# EAGLE design powerSMALL_smaller_OUT_GND (EAGLE 9.0.0)
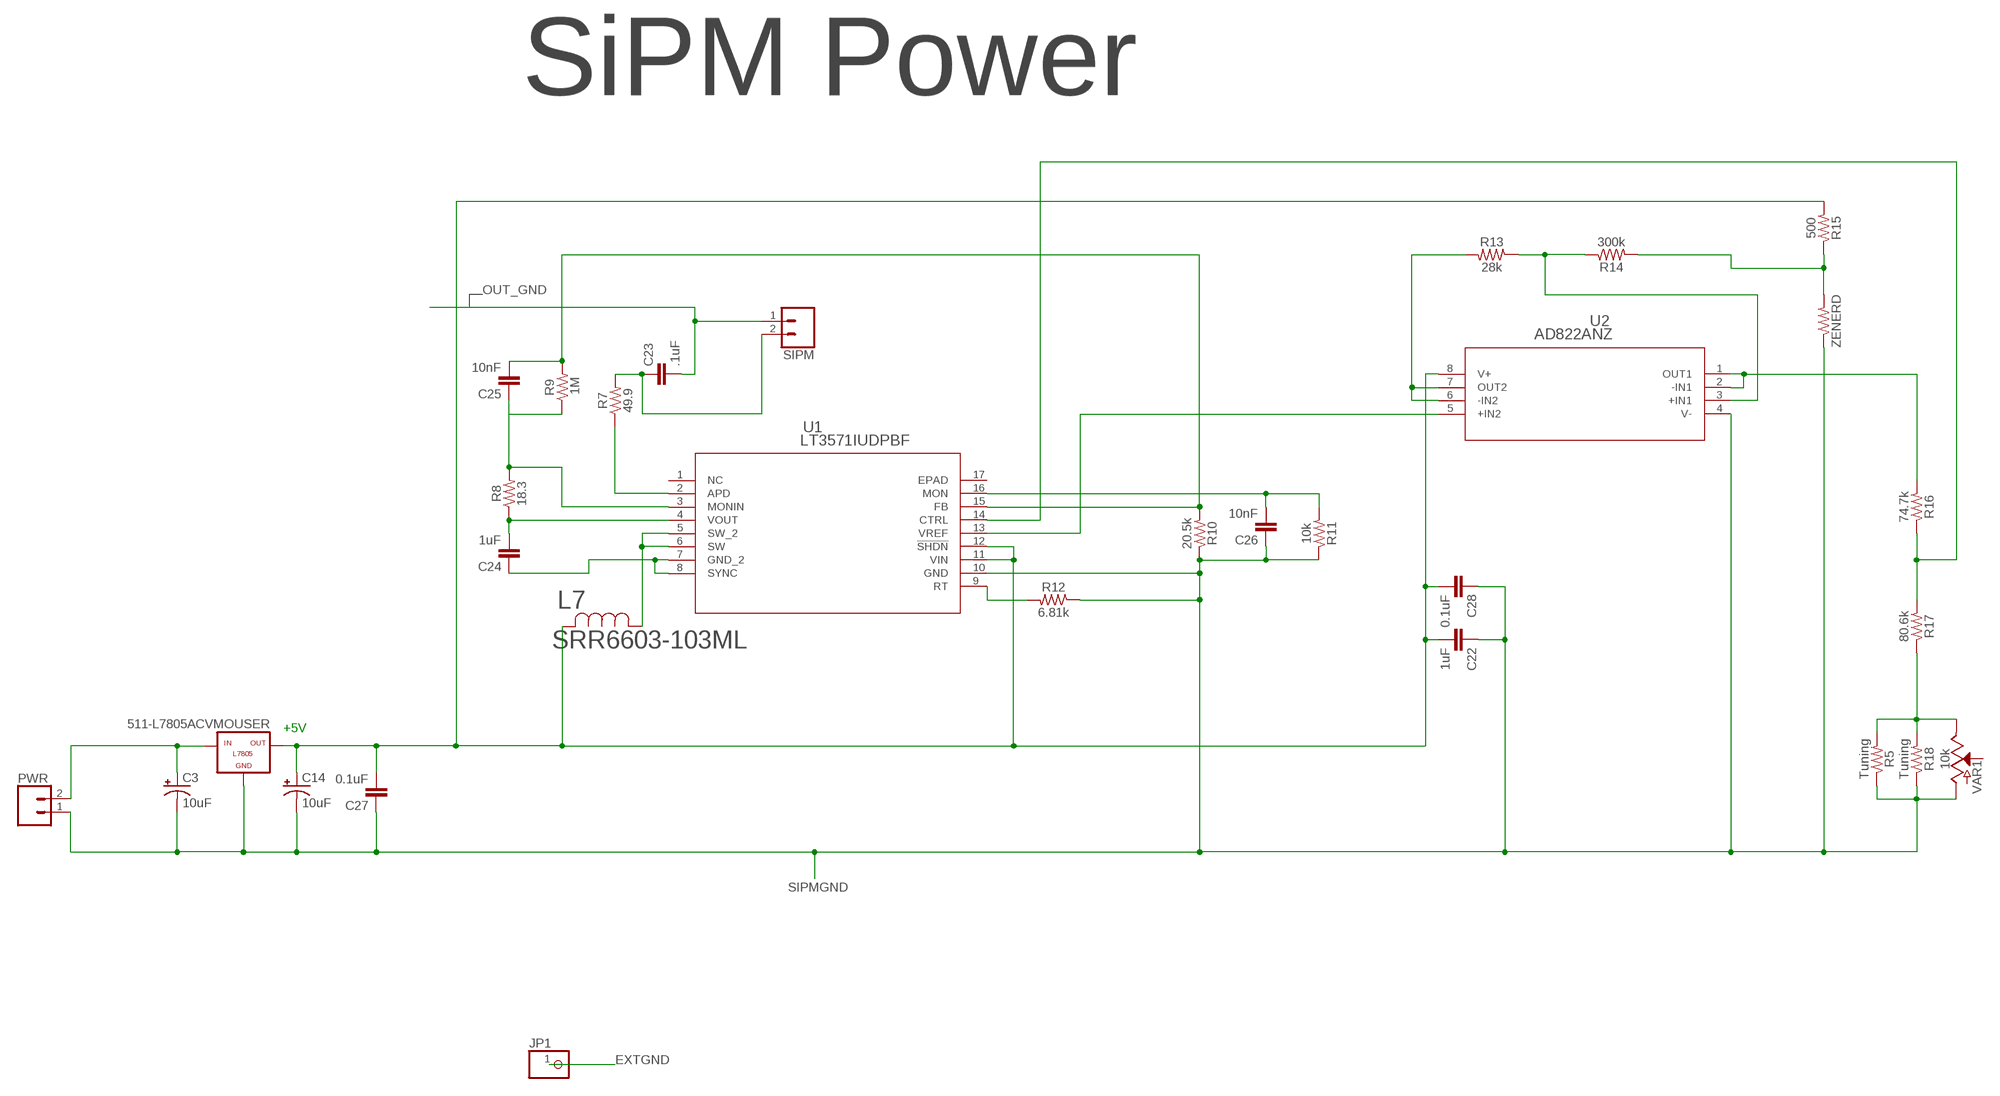
[diagram p0: schematic, sheet 1, part 1 of 2]
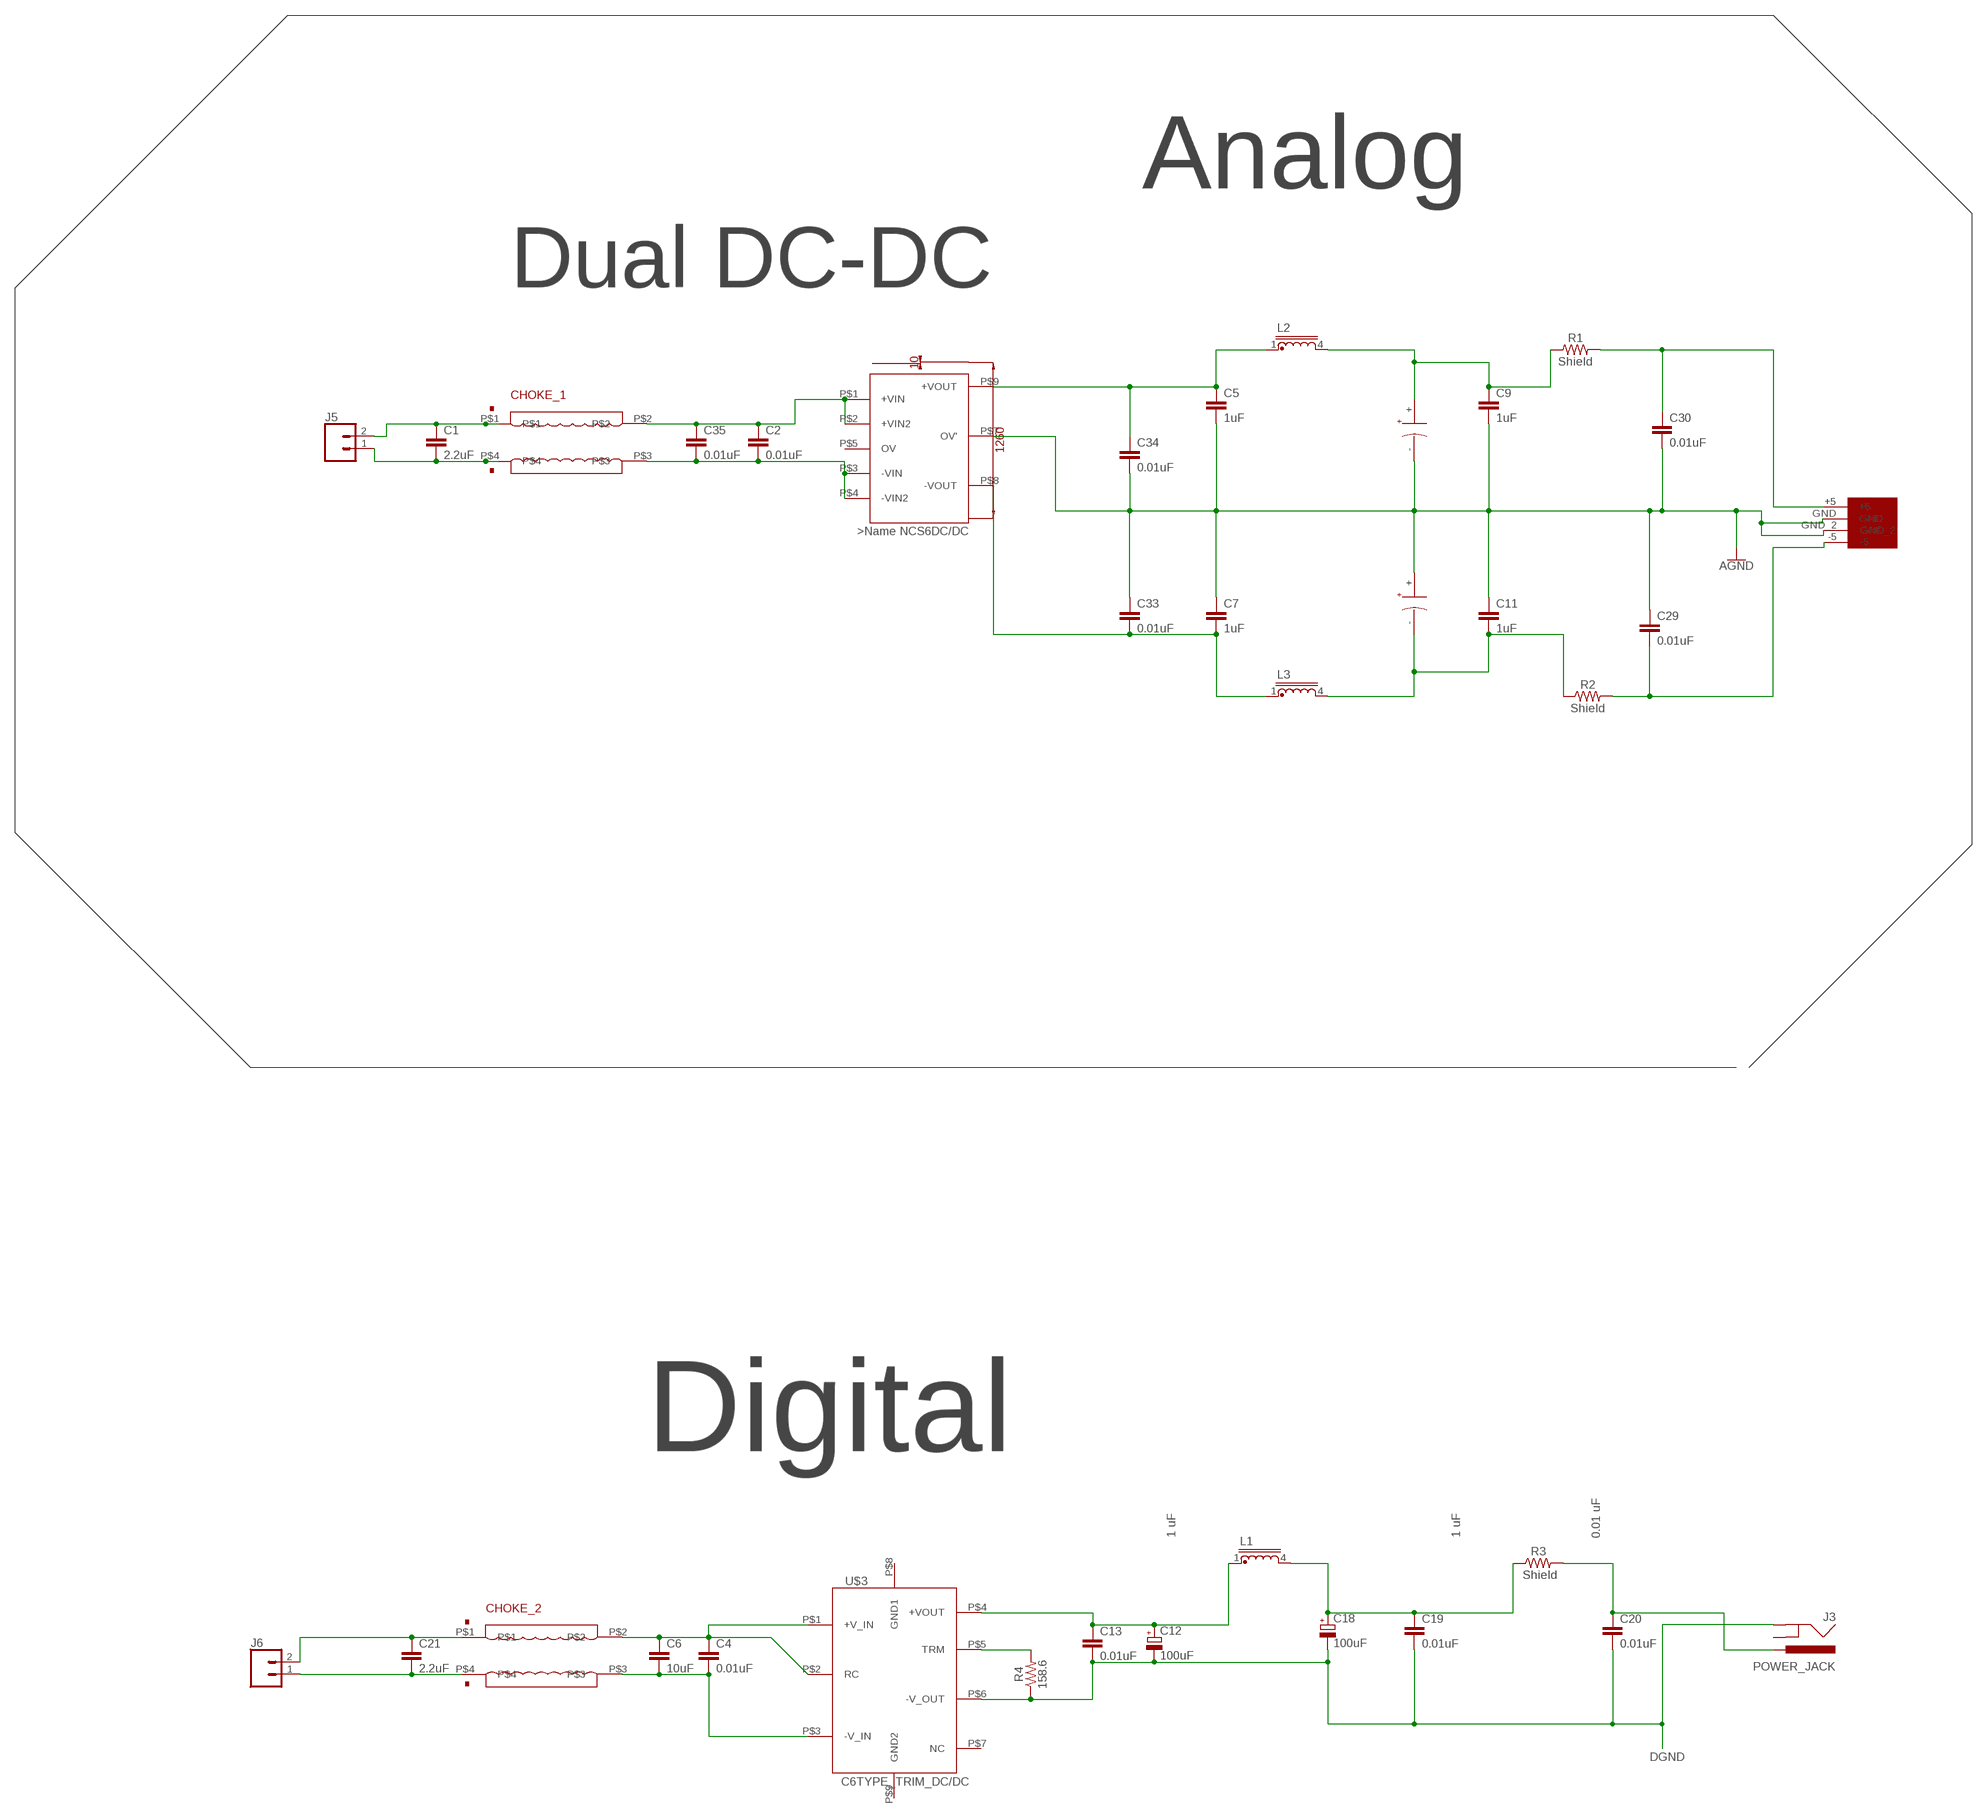
[diagram p1: schematic, sheet 1, part 2 of 2]

## Parts
511-L7805ACVMOUSER  -L7805  [L7805]
C1  2.2uF  C-EU050-024X044  [C050-024X044]
C2  0.01uF  C-EU025-025X050  [C025-025X050]
C3  10uF  CPOL-USB/3528-21R  [T/3528-12R]
C4  0.01uF  C-EU025-025X050  [C025-025X050]
C5  1uF  C-EU025-025X050  [C025-025X050]
C6  10uF  C-EU025-025X050  [C025-025X050]
C7  1uF  C-EU025-025X050  [C025-025X050]
C8  150uF  399-4567-ND  [399-3567-ND150UF]
C9  1uF  C-EU025-025X050  [C025-025X050]
C10  150uF  399-4567-ND  [399-3567-ND150UF]
C11  1uF  C-EU025-025X050  [C025-025X050]
C12  100uF  CPOL-EUC/6032-28R  [C/6032-28R]
C13  0.01uF  C-EU025-025X050  [C025-025X050]
C14  10uF  CPOL-USB/3528-21R  [T/3528-12R]
C18  100uF  CPOL-EUC/6032-28R  [C/6032-28R]
C19  0.01uF  C-EU025-025X050  [C025-025X050]
C20  0.01uF  C-EU025-025X050  [C025-025X050]
C21  2.2uF  C-EU050-024X044  [C050-024X044]
C22  1uF  C-EU025-025X050  [C025-025X050]
C23  .1uF  C2.5/2  [C2.5-2]
C24  1uF  C-EU025-025X050  [C025-025X050]
C25  10nF  C2.5/2  [C2.5-2]
C26  10nF  C2.5/2  [C2.5-2]
C27  0.1uF  C2.5/2  [C2.5-2]
C28  0.1uF  C2.5/2  [C2.5-2]
C29  0.01uF  C-EUC0603  [C0603]
C30  0.01uF  C-EUC0603  [C0603]
C33  0.01uF  C-EUC0603  [C0603]
C34  0.01uF  C-EUC0603  [C0603]
C35  0.01uF  C-EUC0603  [C0603]
CHOKE_1  DN4730-ND  [DN4730-ND]
CHOKE_2  DN4730-ND  [DN4730-ND]
J3  POWER_JACK  [POWER_JACK_PTH]
J5  CONN_02PTH4  [1X02_XTRA_BIG]
J6  CONN_02PTH4  [1X02_XTRA_BIG]
JP1  PINHD-1X1  [1X01]
L1  U15-CHOKE  [U15CHOKE]
L2  U15-CHOKE  [U15CHOKE]
L3  U15-CHOKE  [U15CHOKE]
L7  SRR6603-103ML  [IND_BOURNS_SRR6603]
PWR  CONN_02PTH4  [1X02_XTRA_BIG]
PWR_JACK  WM403_NDPOWER_JACK  [WM4302-ND]
R1  Shield  RESISTORAXIAL-0.3  [AXIAL-0.3]
R2  Shield  RESISTORAXIAL-0.3  [AXIAL-0.3]
R3  Shield  RESISTORAXIAL-0.3  [AXIAL-0.3]
R4  158.6  RESISTORAXIAL-0.3  [AXIAL-0.3]
R5  Tuning  RESISTORAXIAL-0.3  [AXIAL-0.3]
R7  49.9  RESISTORAXIAL-0.3  [AXIAL-0.3]
R8  18.3  RESISTORAXIAL-0.3  [AXIAL-0.3]
R9  1M  RESISTORAXIAL-0.3  [AXIAL-0.3]
R10  20.5k  RESISTORAXIAL-0.3  [AXIAL-0.3]
R11  10k  10KOHM-HORIZ-1/4W-1%  [AXIAL-0.3]
R12  6.81k  RESISTORAXIAL-0.3  [AXIAL-0.3]
R13  28k  RESISTORAXIAL-0.3  [AXIAL-0.3]
R14  300k  RESISTORAXIAL-0.3  [AXIAL-0.3]
R15  500  RESISTORAXIAL-0.3  [AXIAL-0.3]
R16  74.7k  RESISTORAXIAL-0.3  [AXIAL-0.3]
R17  80.6k  RESISTORAXIAL-0.3  [AXIAL-0.3]
R18  Tuning  RESISTORAXIAL-0.3  [AXIAL-0.3]
SIPM  CONN_02PTH4  [1X02_XTRA_BIG]
U1  LT3571IUDPBF  [QFN-16_UD]
U2  AD822ANZ  [N_8]
U$1  NCS6D1205  [NCS6D1205C]
U$3  C6TYPE_TRIM_DC/DC  [CONV/DC/DC_6W_SNGL_C6TYPE]
VAR1  10k  POTENTIOMETER-PTH-9MM-1/20W-20%  [POT-PTH-ALPS]
ZENERD  RESISTORAXIAL-0.3  [AXIAL-0.3]

## Nets
5VSUPPLY: 511-L7805ACVMOUSER.OUT C14.+ C22.2 C27.2 C28.2 L7.2 R15.P$2 U1.11(VIN) U1.12(!SHDN) U2.8(V+)
-FINV: C30.1 PWR_JACK.+5 R1.P$2
AGND: C5.2 C7.1 C8.-(N) C9.2 C10.+(P) C11.1 C29.1 C30.2 C33.1 C34.2 PWR_JACK.GND PWR_JACK.GND_2 U$1.P$7(OV')
DGND: C12.- C13.2 C18.- C19.2 C20.2 J3.GND R4.P$1 U$3.P$6(-V_OUT)
EXTGND: JP1.1
N$1: C1.1 CHOKE_1.P$1 J5.2
N$2: C1.2 CHOKE_1.P$4 J5.1
N$3: C7.2 C33.2 L3.1 U$1.P$8(-VOUT)
N$4: C2.1 C35.1 CHOKE_1.P$2 U$1.P$1(+VIN) U$1.P$2(+VIN2)
N$6: C8.+(P) C9.1 L2.4 R1.P$1
N$7: R13.P$2 U2.6(-IN2) U2.7(OUT2)
N$8: C10.-(N) C11.2 L3.4 R2.P$1
N$9: C29.2 PWR_JACK.-5 R2.P$2
N$10: C21.1 CHOKE_2.P$1 J6.2
N$11: C21.2 CHOKE_2.P$4 J6.1
N$12: C4.1 C6.1 CHOKE_2.P$2 U$3.P$1(+V_IN) U$3.P$2(RC)
N$13: C4.2 C6.2 CHOKE_2.P$3 U$3.P$3(-V_IN)
N$14: C24.2 R8.P$1 U1.4(VOUT)
N$15: C20.1 J3.PWR R3.P$2
N$16: R4.P$2 U$3.P$5(TRM)
N$17: C18.+ C19.1 L1.4 R3.P$1
N$18: C24.1 U1.7(GND_2) U1.8(SYNC)
N$19: C12.+ C13.1 L1.1 U$3.P$4(+VOUT)
N$20: R7.P$1 U1.2(APD)
N$21: C23.1 R7.P$2 SIPM.2
N$22: C25.1 R8.P$2 R9.P$1 U1.3(MONIN)
N$23: C26.2 R11.P$2 U1.16(MON)
N$24: L7.1 U1.5(SW_2) U1.6(SW)
N$25: U1.13(VREF) U2.5(+IN2)
N$26: C5.1 C34.1 L2.1 U$1.P$9(+VOUT)
N$27: R16.P$2 U2.1(OUT1) U2.2(-IN1)
N$28: C25.2 R9.P$2 R10.P$2 U1.15(FB)
N$29: R13.P$1 R14.P$1 U2.3(+IN1)
N$30: R12.P$2 U1.9(RT)
N$31: R14.P$2 R15.P$1 ZENERD.P$2
N$33: R16.P$1 R17.P$2 U1.14(CTRL)
N$34: R5.P$2 R17.P$1 R18.P$2 VAR1.P$1(E)
N$35: C2.2 C35.2 CHOKE_1.P$3 U$1.P$3(-VIN) U$1.P$4(-VIN2)
N$36: 511-L7805ACVMOUSER.IN C3.+ PWR.2
OUT_GND: C23.2 SIPM.1
SIPMGND: 511-L7805ACVMOUSER.GND C3.- C14.- C22.1 C26.1 C27.1 C28.1 PWR.1 R5.P$1 R10.P$1 R11.P$1 R12.P$1 R18.P$1 U1.10(GND) U2.4(V-) VAR1.P$3(A) ZENERD.P$1
Unconnected: J3.GNDBREAK U1.1(NC) U1.17(EPAD) U$1.P$5(OV) U$3.P$7(NC) U$3.P$8(GND1) U$3.P$9(GND2) VAR1.P$2(S)

## Notes on the sheet
- SiPM Power
- +5V
- Analog
- Dual DC-DC
- Digital
- 1 uF | 1 uF
- 0.01 uF

## Library data of the parts
511-L7805ACVMOUSER = tango:-L7805; OC_NEWARK: unknown
C1 C2 C4-C7 C9 C11 C13 C19-C22 C24 = resistor:C-EU: CAPACITOR, European symbol; OC_NEWARK: unknown
C3 C14 = resistor:CPOL-US: POLARIZED CAPACITOR, American symbol
C8 C10 = 399-3567-ND150uF:399-4567-ND
C12 = resistor:CPOL-EU: POLARIZED CAPACITOR, European symbol; OC_NEWARK: unknown
C18 = resistor:CPOL-EU: POLARIZED CAPACITOR, European symbol; OC_NEWARK: unknown; SPICEPREFIX: C
C23 C25-C28 = capacitor-wima:C: CAPACITOR naming: grid - package width; OC_NEWARK: unknown
C29 C30 C33-C35 = resistor:C-EU: CAPACITOR, European symbol
CHOKE_1 CHOKE_2 = DN4730-ND_Com_Choke:DN4730-ND: Surface Mount Common Mode Choke Digikey: DN4730-ND 100uH
J3 = SparkFun-Connectors:POWER_JACK: Power Jack Connector This is the standard 5.5mm barrel jack for power. The PTH is the most common, proven, reliable, footprint. The Slot footprint only works if the mill layer is transmitted to the PCB fab house so be warned. Here are the connectors we sell at SparkFun: DC Barrel Power Jack/Connector <https://www.sparkfun.com/products/119> (PRT-00119) DC Barrel Power Jack/Connector (SMD) <https://www.sparkfun.com/products/12748> (PRT-12748) DC Barrel Jack Adapter - Breadboard Compatible <https://www.sparkfun.com/products/10811> (PRT-10811) It is used on this SparkFun product (and many, many others): SparkFun RedBoard - Programmed with Arduino <https://www.sparkfun.com/products/12757> (DEV-12757) Also, if you need a mating power supply or connector, please check these out: Wall Adapter Power Supply - 9VDC 650mA <https://www.sparkfun.com/products/298> (TOL-00298) DC Barrel Jack Adapter - Male <https://www.sparkfun.com/products/10287> (PRT-10287); OC_NEWARK: unknown; PROD_ID: CONN-08197
J5 J6 PWR SIPM = SparkFun-Connectors:CONN_02: Multi connection point. Often used as Generic Header-pin footprint for 0.1 inch spaced/style header connections On any of the 0.1 inch spaced packages, you can populate with these: Break Away Headers - Straight <https://www.sparkfun.com/products/116> (PRT-00116) Break Away Male Headers - Right Angle <https://www.sparkfun.com/products/553> (PRT-00553) Female Headers <https://www.sparkfun.com/products/115> (PRT-00115) Break Away Headers - Machine Pin <https://www.sparkfun.com/products/117> (PRT-00117) Break Away Female Headers - Swiss Machine Pin <https://www.sparkfun.com/products/743> (PRT-00743) For SCREWTERMINALS and SPRING TERMINALS visit here: Screw Terimnals on SparkFun.com <https://www.sparkfun.com/search/results?term=Screw+Terminals> (5mm/3.5mm/2.54mm spacing) This device is also useful as a general connection point to wire up your design to another part of your project. Our various solder wires solder well into these plated through hole pads. Hook-Up Wire - Assortment (Stranded, 22 AWG) <https://www.sparkfun.com/products/11375> (PRT-11375) Hook-Up Wire - Assortment (Solid Core, 22 AWG) <https://www.sparkfun.com/products/11367> (PRT-11367) View the entire wire category on our website here <https://www.sparkfun.com/categories/141> Special notes: Molex polarized connector foot print use with: PRT-08233 with associated crimp pins and housings. 2.54_SCREWTERM for use with PRT-10571. 3.5mm Screw Terminal footprints for PRT-08084 5mm Screw Terminal footprints for use with PRT-08432; OC_NEWARK: unknown
JP1 = adafruit:PINHD-1X1: Pin header 1x1 for 0.1" spacing With round pins; OC_NEWARK: unknown
L1-L3 = inductor-neosid:U15-: CHOKE U15; OC_FARNELL: unknown; OC_NEWARK: unknown
L7 = SRR6603-10MLTR-ND:SRR6603-103ML; MANUFACTURER_PART_NUMBER: SRR6603103ML; OC_NEWARK: unknown; VENDOR: Bourns Electronics
PWR_JACK = WM4302-ND:WM403_ND; OC_NEWARK: unknown
R1-R5 R7-R10 R12-R18 ZENERD = SparkFun-Resistors:RESISTOR: Generic Resistor Package; OC_NEWARK: unknown
R11 = SparkFun-Resistors:10KOHM: 10kΩ resistor A resistor is a passive two-terminal electrical component that implements electrical resistance as a circuit element. Resistors act to reduce current flow, and, at the same time, act to lower voltage levels within circuits. - Wikipedia; OC_NEWARK: unknown; PROD_ID: RES-12183
U1 = LT3571:LT3571IUDPBF; MANUFACTURER_PART_NUMBER: LT3571IUD#PBF; OC_NEWARK: unknown; VENDOR: Linear Technology
U2 = AD822ANZ_opAmp:AD822ANZ; MANUFACTURER_PART_NUMBER: AD822ANZ; OC_NEWARK: unknown; VENDOR: Analog Devices Inc
U$1 = LAFTRPWR:NCS6D1205; OC_NEWARK: unknown
U$3 = DCDC_Trim:C6TYPE_TRIM_DC/DC; OC_NEWARK: unknown
VAR1 = SparkFun-Resistors:POTENTIOMETER: Potentiometer (Pot) Three-terminal potentiometers, with an adjustable wiper and two adjustable resistors. A pot can be used to create a configurable voltage divider, or as a variable resistor. Variants ALPS_POT and ALPS_POT_KIT - PTH, breadboard compatible, 9mm square pots Rotary Potentiometer - Linear (10k ohm) <https://www.sparkfun.com/products/9288> (COM-09288) The KIT variant exposes copper on only one side of the PTH pad, so the part can only be assembled on one side of the PCB. Useful for beginner soldering kits.; OC_NEWARK: unknown; PROD_ID: RES-09177; SF_SKU: COM-09288

## Board
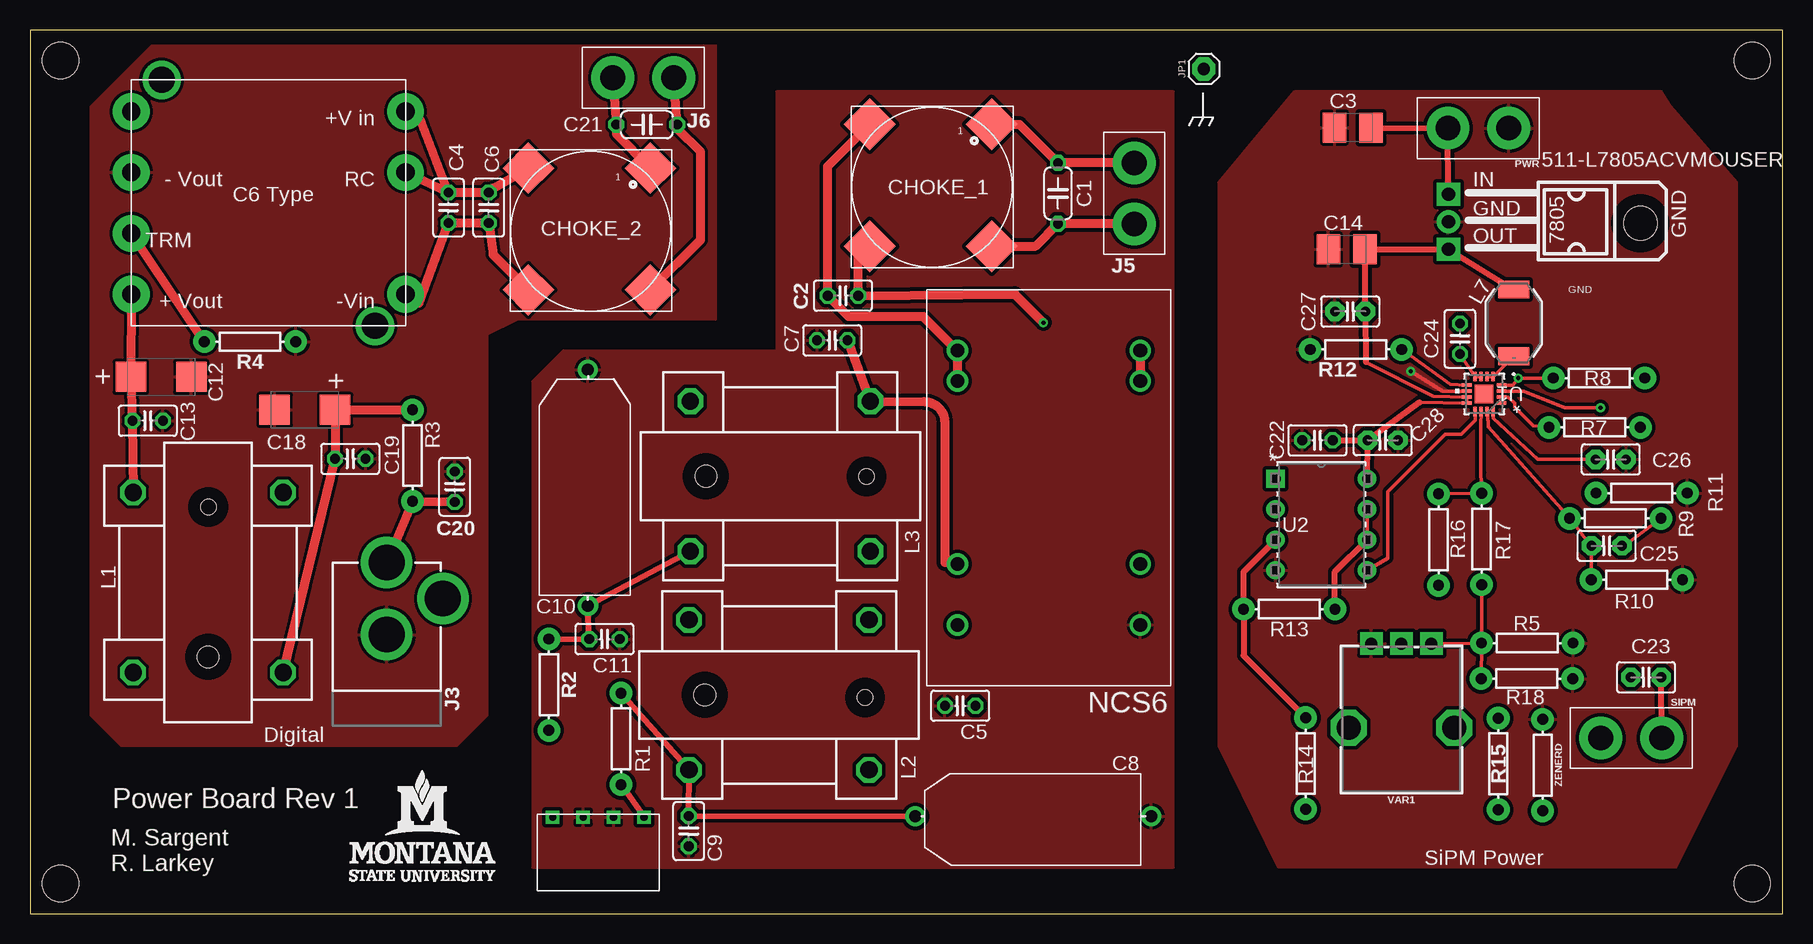
[diagram p2: board, top side]
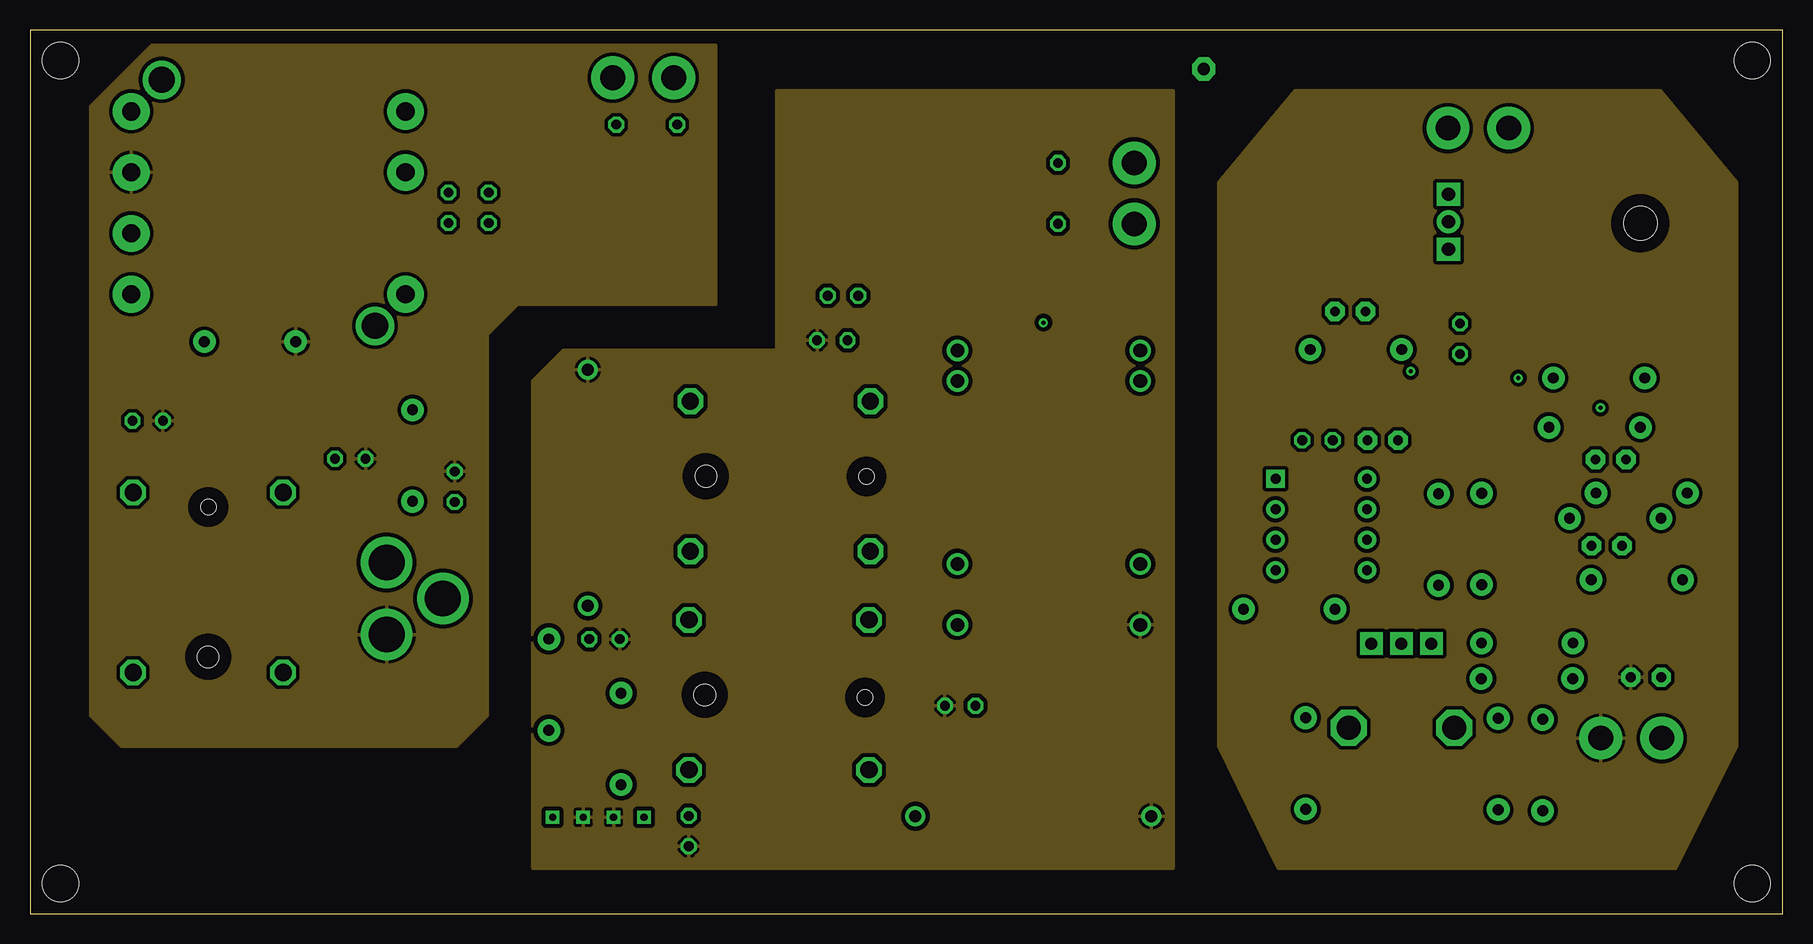
[diagram p3: board, inner layer Route2]
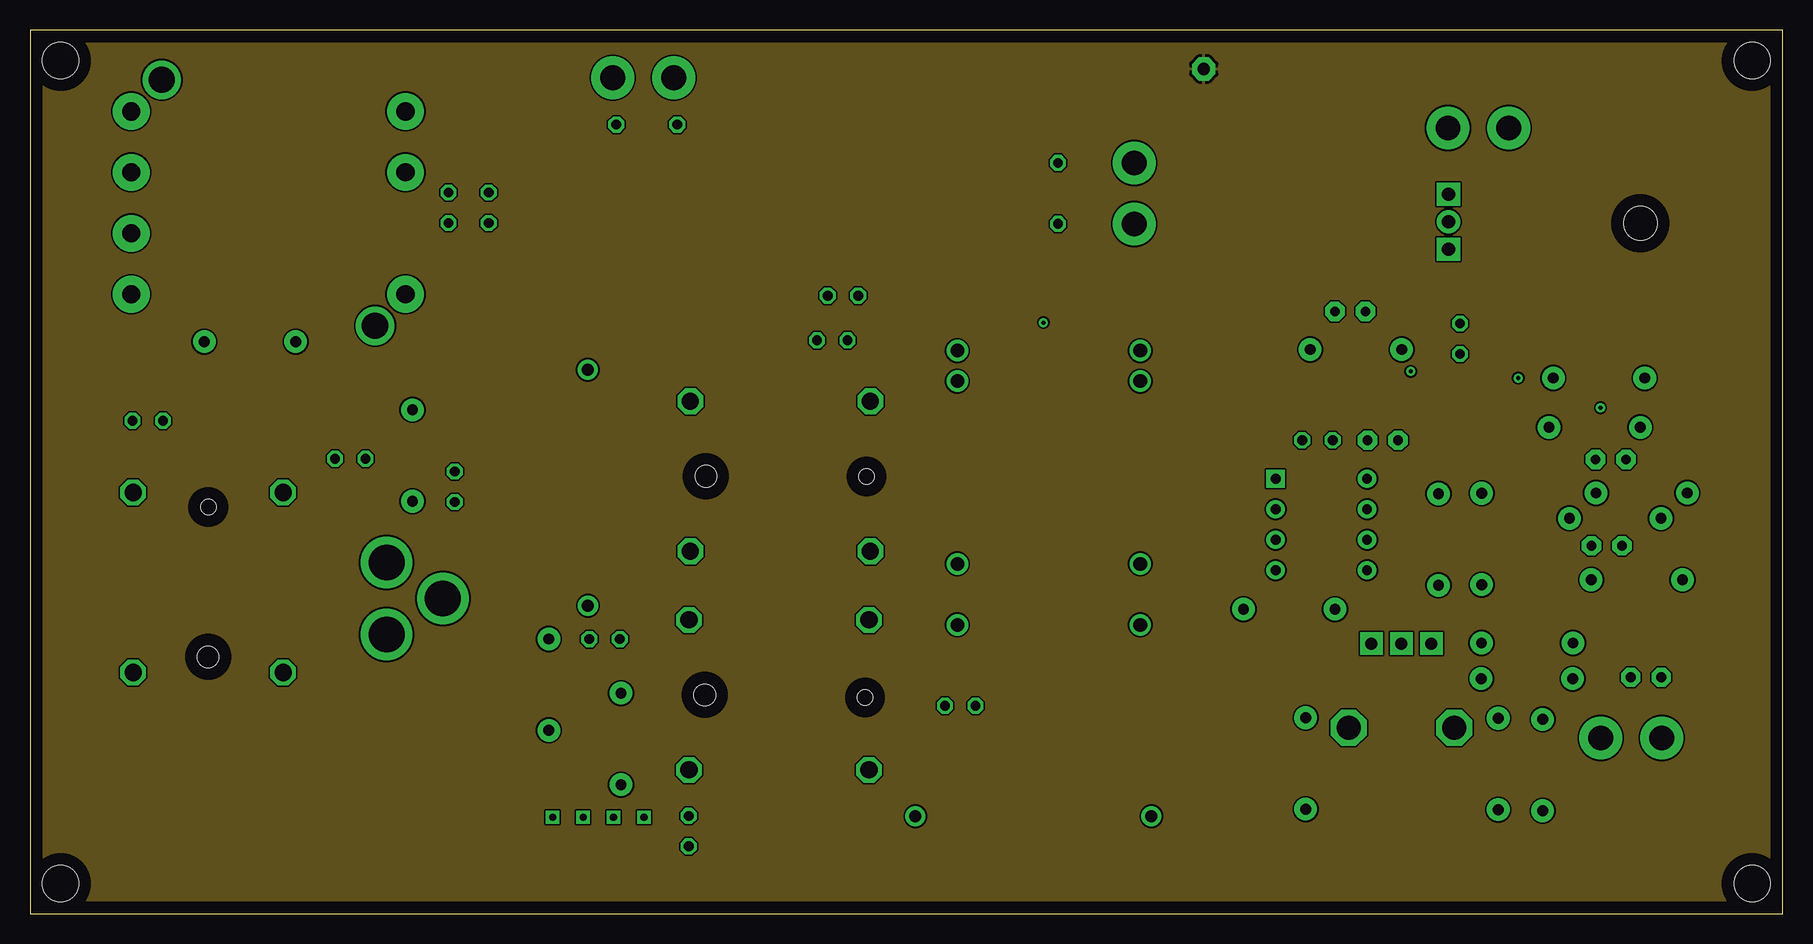
[diagram p4: board, inner layer Route15]
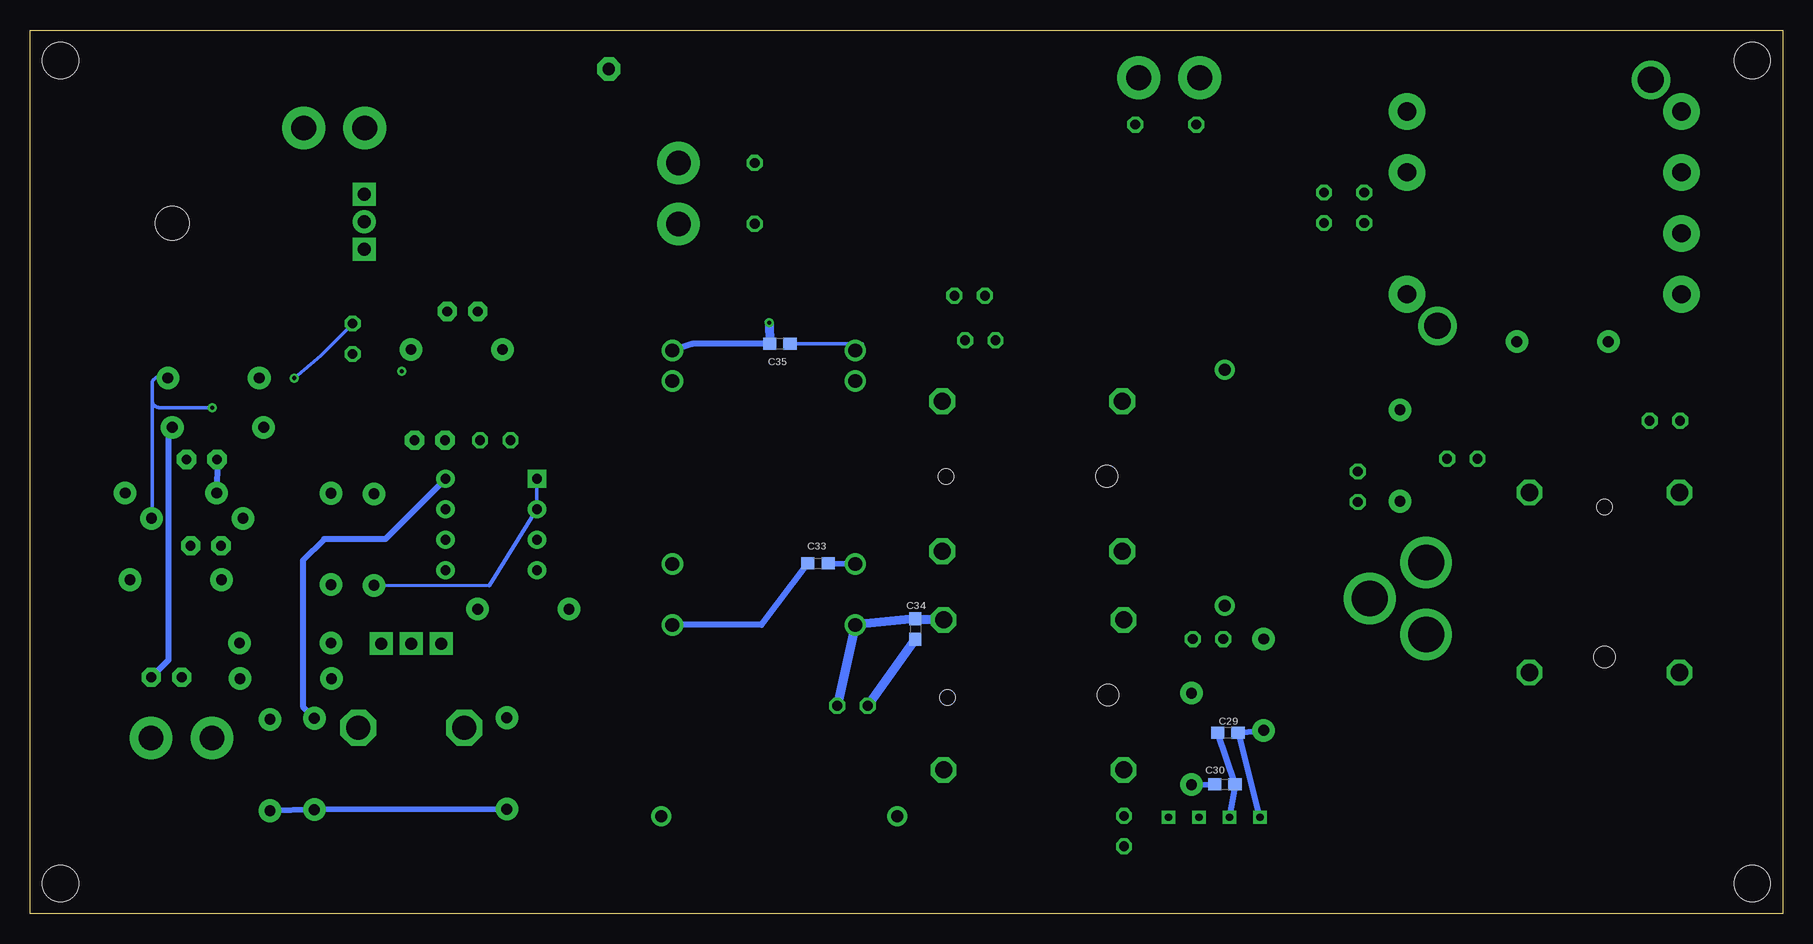
[diagram p5: board, bottom side, seen from below]

Size 146.05 x 73.66 mm. Coordinates in mm from the lower left corner, seen from the top.
Outline: 0,0 146.05,0 146.05,73.66 0,73.66 0,0
Copper layers (1*2+15*16): Top 0.035mm / dielectric 1.5mm / Route2 0.035mm / dielectric 0.15mm / Route15 0.035mm / dielectric 0.2mm / Bottom 0.035mm
Design rules "default *": minimum track width 6mil, minimum drill 0.35mm, track to track 6mil, track to pad 6mil, pad to pad 6mil, via to via 6mil, smd to smd 6mil, copper to edge 40mil, drill to drill 6mil, minimum pad ring 10mil, minimum via ring 8mil, stop-mask expansion 4mil, vias tented up to drill 0mil, thermal gap 10mil
Holes 3 mm at 2.54,71.12 2.54,2.54 143.51,2.54 143.51,71.12
Holes 1.27 mm at 69.72,36.45 69.6,18.03 14.86,33.91

### Footprints (pad centres in the part's own frame; a part is rotated, then mirrored left to right if it is on the bottom)
L7805 = drill 1.1 pad 1.93: GND 0.127,-9.652 | drill 1.1 pad 1.93 square: IN -2.159,-9.652; OUT 2.413,-9.652 | hole 2.8: 0.254,6.35
C050-024X044 = drill 0.813 octagon: 1 -2.54,0; 2 2.54,0
C025-025X050 = drill 0.813 octagon: 1 -1.27,0; 2 1.27,0
T/3528-12R = smd 1.95 x 2.5: + 1.525,0; - -1.525,0
399-3567-ND150UF = drill 1 pad 1.676: + 18.8,3.55; - -0.87,3.54
C/6032-28R = smd 2.55 x 2.5: + 2.525,0; - -2.525,0
C2.5-2 = drill 0.813 pad 1.6 octagon: 1 -1.27,0; 2 1.27,0
C0603 = smd 1.1 x 1: 1 -0.85,0; 2 0.85,0
DN4730-ND = smd 3.048 x 3.048 rotated 45: P$1 1.524,11.684; P$2 1.524,1.524 | smd 3.048 x 3.048 rotated 225: P$3 11.684,1.524; P$4 11.684,11.684
POWER_JACK_PTH = drill 2.997 pad 4.318: GND 0,7.7; GNDBREAK 4.7,10.7; PWR 0,13.7
1X02_XTRA_BIG = drill 2.057 pad 3.556: 1 -2.54,0; 2 2.54,0
1X01 = drill 1.016 pad 1.93 octagon: 1 0,0
U15CHOKE = drill 1.422 octagon: 1 -7.5,-6.25; 4 7.5,6.25; U2 -7.5,6.25; U3 7.5,-6.25 | hole 1.8: 6.2,0
IND_BOURNS_SRR6603 = smd 1.46 x 2.591: 1 -2.775,0; 2 2.775,0
WM4302-ND = drill 0.6 square: +5 1.27,0.23; -5 8.89,0.23; GND 3.81,0.23; GND_2 6.35,0.23
AXIAL-0.3 = drill 0.9 pad 1.88: P$1 -3.81,0; P$2 3.81,0
QFN-16_UD = smd 0.805 x 0.3: 1 -1.452,0.75; 2 -1.452,0.25; 3 -1.452,-0.25; 4 -1.452,-0.75; 9 1.452,-0.75; 10 1.452,-0.25; 11 1.452,0.25; 12 1.452,0.75 | smd 0.3 x 0.805: 5 -0.75,-1.452; 6 -0.25,-1.452; 7 0.25,-1.452; 8 0.75,-1.452; 13 0.75,1.452; 14 0.25,1.452; 15 -0.25,1.452; 16 -0.75,1.452 | smd 1.55 x 1.55: 17 0,0
N_8 = drill 0.813 pad 1.524 square: 1 -7.62,7.62 | drill 0.813 pad 1.524: 2 -7.62,5.08; 3 -7.62,2.54; 4 -7.62,0; 5 0,0; 6 0,2.54; 7 0,5.08; 8 0,7.62
NCS6D1205C = drill 1.143 pad 1.778: P$1 0,0; P$2 2.54,0; P$3 0,15.24; P$4 2.54,15.24; P$5 17.78,15.24; P$7 22.86,15.24; P$8 17.78,0; P$9 22.86,0
CONV/DC/DC_6W_SNGL_C6TYPE = drill 1.524 pad 3.048: P$1 0,2.63; P$2 0,7.71; P$3 0,17.87; P$4 22.86,17.87; P$5 22.86,12.79; P$6 22.86,7.71; P$7 22.86,2.63 | drill 2.184 pad 3.048: P$8 2.54,20.5; P$9 20.32,0
POT-PTH-ALPS = drill 1 pad 1.88 square: P$1 7,-2.5; P$2 7,0; P$3 7,2.5 | drill 2 octagon: P$4 0,-4.4; P$5 0,4.4

### Placement (x,y rotation side)
511-L7805ACVMOUSER  127.85,57.81 270 top
C1  85.66,60.05 270 top
C2  67.75,51.52 0 top
C3  110.24,65.53 0 top
C4  34.87,58.85 270 top
C5  77.52,17.35 180 top
C6  38.22,58.85 270 top
C7  66.86,47.8 0 top
C8  92.58,11.68 180 top
C9  54.89,6.9 270 top
C10  50.04,26.54 90 top
C11  47.88,22.9 180 top
C12  10.93,44.75 180 top
C13  9.81,41.1 0 top
C14  109.73,55.37 0 top
C18  22.91,42 0 top
C19  26.69,37.93 0 top
C20  35.39,35.6 90 top
C21  51.4,65.78 0 top
C22  107.28,39.47 0 top
C23  134.67,19.71 180 top
C24  119.17,47.93 90 top
C25  131.39,30.68 180 top
C26  131.73,37.87 180 top
C27  110.02,50.21 0 top
C28  112.73,39.48 180 top
C29  46.23,15.11 0 bottom
C30  46.48,10.79 0 bottom
C33  80.39,29.21 0 bottom
C34  72.26,23.75 270 bottom
C35  83.57,47.5 180 bottom
CHOKE_1  68.46,67.33 270 top
CHOKE_2  40.02,63.68 270 top
J3  29.71,15.58 0 top
J5  92.01,60.05 90 top
J6  51.11,69.68 180 top
JP1  97.82,70.41 0 top
L1  14.84,27.62 270 top
L2  62.42,18.25 180 top
L3  62.53,36.47 180 top
L7  123.65,49.25 90 top
PWR  120.7,65.48 180 top
PWR_JACK  52.44,8.29 180 top
R1  49.26,14.58 270 top
R2  43.24,19.1 270 top
R3  31.88,38.2 270 top
R4  18.33,47.69 180 top
R5  124.78,22.58 180 top
R7  130.39,40.55 0 top
R8  130.75,44.66 0 top
R9  132.11,32.97 180 top
R10  133.9,27.85 180 top
R11  134.31,35.07 180 top
R12  110.49,47.04 0 top
R13  104.94,25.4 0 top
R14  106.31,12.54 270 top
R15  122.35,12.5 90 top
R16  117.38,31.19 270 top
R17  120.97,31.24 90 top
R18  124.74,19.61 180 top
SIPM  133.43,14.66 0 top
U1  121.18,43.33 180 top
U2  111.42,28.64 0 top
U$1  77.28,46.95 270 top
U$3  31.3,69.51 180 top
VAR1  114.28,15.52 90 top
ZENERD  126.06,12.41 270 top

### Tracks (layer width: path | path; a pad name or v marks a point on that pad's centre or on a via)
5VSUPPLY
  Top 0.305: 115.78,42.62 U1.12 U1.11 116.94,43.12 111.32,45.99 | 118.18,55.37 511-L7805ACVMOUSER.OUT
  Top 0.508: 511-L7805ACVMOUSER.OUT L7.2 | C22.2 C28.2 | C28.2 115.78,42.62 | U2.8 C28.2 | 111.32,45.99 C27.2 C14.+ 118.18,55.37
  Bottom 0.508: 111.56,36.4 U2.8 116.44,31.24 121.54,31.24 123.32,29.46 123.32,17.27 R15.P$2
-FINV
  Top 0.508: R1.P$2 PWR_JACK.+5
  Bottom 0.508: R1.P$2 C30.1
AGND
  Bottom 0.508: C33.1 85.09,24.09 U$1.P$7 | C29.1 C30.2 PWR_JACK.GND_2
  Bottom 0.762: C34.2 C5.2
  pour Route2 (isolate 0.356): 62.23,68.58 62.23,46.99 44.45,46.99 41.91,44.45 41.91,3.81 95.25,3.81 95.25,68.58
  pour Top (isolate 0.305): 62.23,68.58 95.25,68.58 95.25,3.81 41.91,3.81 41.91,44.45 44.45,46.99 62.23,46.99
DGND
  pour Route2 (isolate 0.305): 57.15,72.39 57.15,50.8 40.64,50.8 38.1,48.26 38.1,16.51 35.56,13.97 7.62,13.97 5.08,16.51 5.08,67.31 10.16,72.39
  pour Top (isolate 0.254): 5.08,67.31 10.16,72.39 57.15,72.39 57.15,49.53 40.64,49.53 38.1,48.26 38.1,16.51 35.56,13.97 7.62,13.97 5.08,16.51
EXTGND
  pour Route15: 0.64,73.03 145.41,73.03 145.41,0.63 0.64,0.63
N$1
  Top 0.762: J5.2 C1.1 82.45,65.8 CHOKE_1.P$1
N$2
  Top 0.762: J5.1 C1.2 83.8,55.64 CHOKE_1.P$4
N$3
  Top 0.762: C7.2 L3.1 74.52,42.68 arc-90 76.24,40.96 76.24,29.26 arc-90 U$1.P$8
  Bottom 0.508: C33.2 77.97,29.17 U$1.P$8
N$4
  Top 0.762: U$1.P$2 U$1.P$1 74.45,49.78 68.22,49.78 C2.1 66.48,62.3 CHOKE_1.P$2
  Bottom 0.305: C35.1 76.69,47.5 U$1.P$1
N$6
  Top 0.508: R1.P$1 L2.4 C9.1 C8.+
N$7
  Top 0.305: U2.6 U2.7
  Top 0.508: R13.P$2 108.75,28.5 U2.6
N$8
  Top 0.508: R2.P$1 C11.2 C10.- L3.4
N$9
  Bottom 0.508: PWR_JACK.-5 43.6,8.1 C29.2 R2.P$2
N$10
  Top 0.762: J6.2 C21.1 48.86,65 CHOKE_2.P$1
N$11
  Top 0.762: J6.1 C21.2 53.94,65.44 55.88,63.5 55.88,56.18 CHOKE_2.P$4
N$12
  Top 0.762: C4.1 32.56,66.13 U$3.P$1 | C4.1 C6.1 38.6,60.49 CHOKE_2.P$2 | U$3.P$2 C4.1
N$13
  Top 0.762: U$3.P$3 32.41,50.89 C4.2 C6.2 38.6,54.93 CHOKE_2.P$3
N$14  (via drill 0.35)
  Top 0.305: R8.P$1 v124.03,44.65 123.58,44.08 U1.4
  Bottom 0.305: v124.03,44.65 121.82,46.52 120.79,47.55 C24.2
N$15
  Top 0.762: C20.1 R3.P$2 J3.PWR
N$16
  Top 0.762: U$3.P$5 R4.P$2
N$17
  Top 0.762: L1.4 C19.1 C18.+ R3.P$1
N$18
  Top 0.305: U1.7 U1.8 C24.1
N$19
  Top 0.762: U$3.P$4 C12.+ C13.1 L1.1
N$20
  Top 0.305: U1.2 123.19,43.08 123.72,42.54 123.72,42.24 125.28,40.68 R7.P$1
N$21
  Top 0.508: SIPM.2 C23.1
  Bottom 0.508: C23.1 134.49,21.16 134.49,40.25 R7.P$2
N$22  (via drill 0.35)
  Top 0.305: C25.1 132.87,30.68 R9.P$1 | U1.3 124.46,43.56 127.89,42.16 v130.87,42.17
  Bottom 0.305: 135.88,42.81 arc-90 135.26,42.19 132.04,42.19 v130.87,42.17 | 135.88,42.81 135.88,44.36 arc90 R8.P$2 | 135.88,42.81 135.88,33.01 R9.P$1
N$23
  Top 0.305: U1.16 121.93,41.32 125.63,37.87 C26.2
  Bottom 0.508: C26.2 R11.P$2
N$24
  Top 0.305: U1.6 U1.5 L7.1
N$25
  Top 0.305: U1.13 120.43,41.16 119.26,39.99 117.95,39.99 113.16,35.19 113.16,29.65 U2.5
N$26
  Bottom 0.508: 72.16,24.5 C34.1
  Bottom 0.762: L2.1 72.16,24.5 | C34.1 U$1.P$9 C5.1
N$27
  Bottom 0.305: U2.1 U2.2 107.77,27.36 R16.P$2
N$28
  Top 0.305: U1.15 121.47,41.83 121.47,41.13 121.5,41.1 121.5,40.6 R9.P$2 130.08,30.68 C25.2 130.12,27.88 R10.P$2
N$29
  Top 0.305: 103.78,31.15 U2.3
  Top 0.508: 103.78,31.15 101.13,28.5 R13.P$1 101.13,21.53 R14.P$1
N$30
  Top 0.305: R12.P$2 118.33,44.12 U1.9
N$31
  Bottom 0.508: R14.P$2 R15.P$1 ZENERD.P$2
N$33
  Top 0.305: R16.P$1 R17.P$2 120.91,36.77 120.91,40.62 | 120.91,40.62 U1.14 | 120.91,40.62
N$34
  Top 0.305: R18.P$2 R5.P$2 | R5.P$2 R17.P$1 | VAR1.P$1 R5.P$2
N$35  (via drill 0.35)
  Top 0.762: U$1.P$3 U$1.P$4 | v84.45,49.28 82.07,51.66 C2.2 69.02,54.68 CHOKE_1.P$3
  Bottom 0.508: C35.2 90.83,47.5 U$1.P$3
  Bottom 0.762: v84.45,49.28 C35.2
N$36
  Top 0.305: 117.98,64.39 PWR.2
  Top 0.508: 511-L7805ACVMOUSER.IN PWR.2 C3.+
OUT_GND
  pour Route2 (isolate 0.305): 135.89,68.58 142.24,60.96 142.24,13.97 137.16,3.81 104.02,3.8 99.06,13.97 99.06,60.96 105.41,68.58
SIPMGND  (via drill 0.35)
  Top 0.305: U1.10 117.71,43.58 v115.06,45.21
  pour Top (isolate 0.305): 105.41,68.58 135.89,68.58 136.71,67.35 142.24,60.96 142.24,13.97 137.16,3.81 137.16,3.81 104.04,3.86 99.06,13.97 99.06,60.96

### Text on the board
tPlace: + | + | Digital | Power Board Rev 1 | M. Sargent / R. Larkey | SiPM Power
tNames: 1 | 1 | GND | NCS6
tSilk: +Vin | +Vin | Analog Power